# EAGLE schematic oresat-camera-card-usb-breakout-v0 (EAGLE 9.5.0)
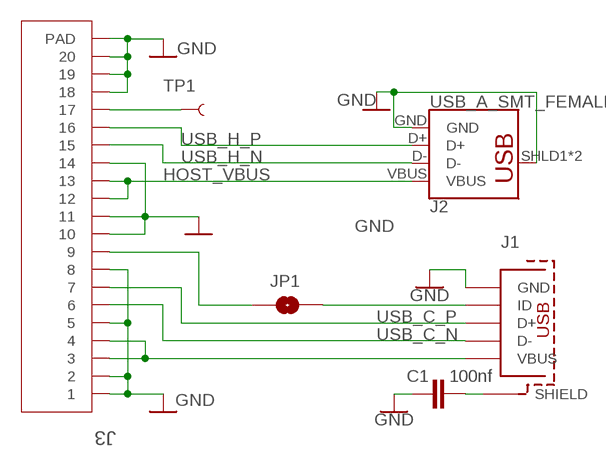
[diagram p0: schematic, sheet 1]

## Parts
C1  100nf  C-EU0603-A  [.0603-A]
J1  MICRO-USB-SOCKET  [629105136821]
J2  USB_A_SMT_FEMALE  [USB-A-S-SILK-FEMALE]
J3  2-1734592-0  [TE_2-1734592-0]
JP1  JUMPER-SMT_2_NO_SILK  [SMT-JUMPER_2_NO_SILK]
TP1  TEST-POINTPOGO_PTH  [1X01_NO_SILK]

## Nets
CLIENT_VBUS: J1.1(VBUS) J3.3 J3.4
GND: C1.1 J1.5(GND) J2.GND J2.SHLD1(SHIELD) J2.SHLD2(SHIELD) J3.1 J3.2 J3.5 J3.8 J3.10 J3.11 J3.14 J3.18 J3.19 J3.20 J3.S1(PAD) J3.S2(PAD)
HOST_VBUS: J2.VBUS J3.12 J3.13
N$1: C1.2 J1.SHELL1(SHIELD) J1.SHELL2(SHIELD) J1.SHELL3(SHIELD) J1.SHELL(SHIELD)
N$2: J3.17 TP1.1
N$3: J1.4(ID) JP1.2
N$5: J3.9 JP1.1
USB_C_N: J1.2(D-) J3.6
USB_C_P: J1.3(D+) J3.7
USB_H_N: J2.D- J3.15
USB_H_P: J2.D+ J3.16

## Library data of the parts
C1 = oresat-rcl:C-EU: CAPACITOR, European symbol
J1 = J-Wurth-629105136821-Micro-USB-A:MICRO-USB-SOCKET: WR-COM SMT Horizontal 5 Contacts Micro USB Type B,5 pins=>Code : Con_I-O_COM_MicroUSB_629105136821 <http://katalog.we-online.de/media/images/eican/Con_I-O_COM_MicroUSB_629105136821_pf2.jpg> Details see: http://katalog.we-online.de/en/em/COM_MICRO_SMT_TYPE_B_HORIZONTAL/629105136821?m Created 2014-07-09, Karrer Zheng 2014 (C) Würth Elektronik
J2 = SparkFun-Connectors:USB_A: USB-A Connector Male and female variants, as well as PTH and SMT variants SparkFun Products: SparkFun XBee Explorer Dongle <https://www.sparkfun.com/products/11697> PTH Male SparkFun MicroView-USB Programmer <https://www.sparkfun.com/products/12924> SMT Male SparkFun USB Type A Female Breakout <https://www.sparkfun.com/products/12700> SMT Female; PROD_ID: CONN-09520; SF_ID: PRT-09011
J3 = J-TEConnectivity-X-1734592-X:2-1734592-0
JP1 = SparkFun-Jumpers:JUMPER-SMT_2_NO: Normally open jumper This jumper has two pads in close proximity to each other. Apply solder to close the connection. Round pads are easier to solder for beginners, but are a lot larger. SparkFun Product that uses the round pads: SparkFun EL Sequencer <https://www.sparkfun.com/products/12781>
TP1 = SparkFun-Connectors:TEST-POINT: SparkFun Test Points Bare copper test points for troubleshooting or In-Circuit-Testing. These are used by our Production team for verifying production board runs using pogo-pins on test beds. SparkFun Products: SparkFun LSM9DS1 Breakout <https://www.sparkfun.com/products/13284> SparkFun PSOC <https://www.sparkfun.com/products/13714> SparkFun Load Cell Amplifier <https://www.sparkfun.com/products/13879>